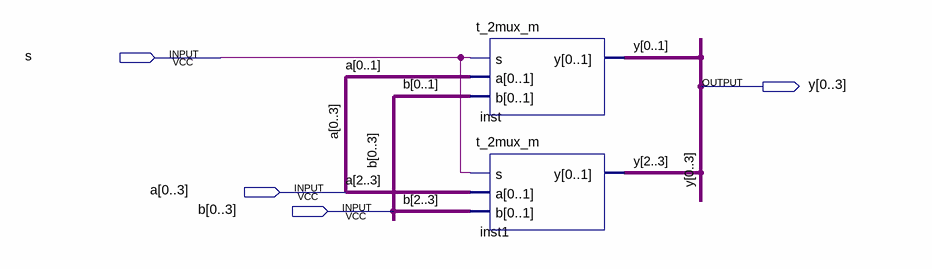
[diagram p0: schematic sheet]
// Quartus schematic t_4mux_m.bdf as structural Verilog: 2 symbols, 4 pins
module t_4mux_m (
  input  s,
  input  [0:3] a,
  input  [0:3] b,
  output [0:3] y
);

  t_2mux_m inst (.s(s), .a(a[0:1]), .b(b[0:1]), .y(y[0:1]));
  t_2mux_m inst1 (.s(s), .a(a[2:3]), .b(b[2:3]), .y(y[2:3]));
endmodule
